# EasyEDA Pro project bend Platform.eprj

# Schematic Schematic1
Board Name: Board1; Create Date: 2025-10-15; Page Name: P1; Project Name: bend Platform; Schematic Name: Schematic1; Update Date: 2025-10-27; Company: nmlstyl.art; Page Size: A4; Version: V1.0
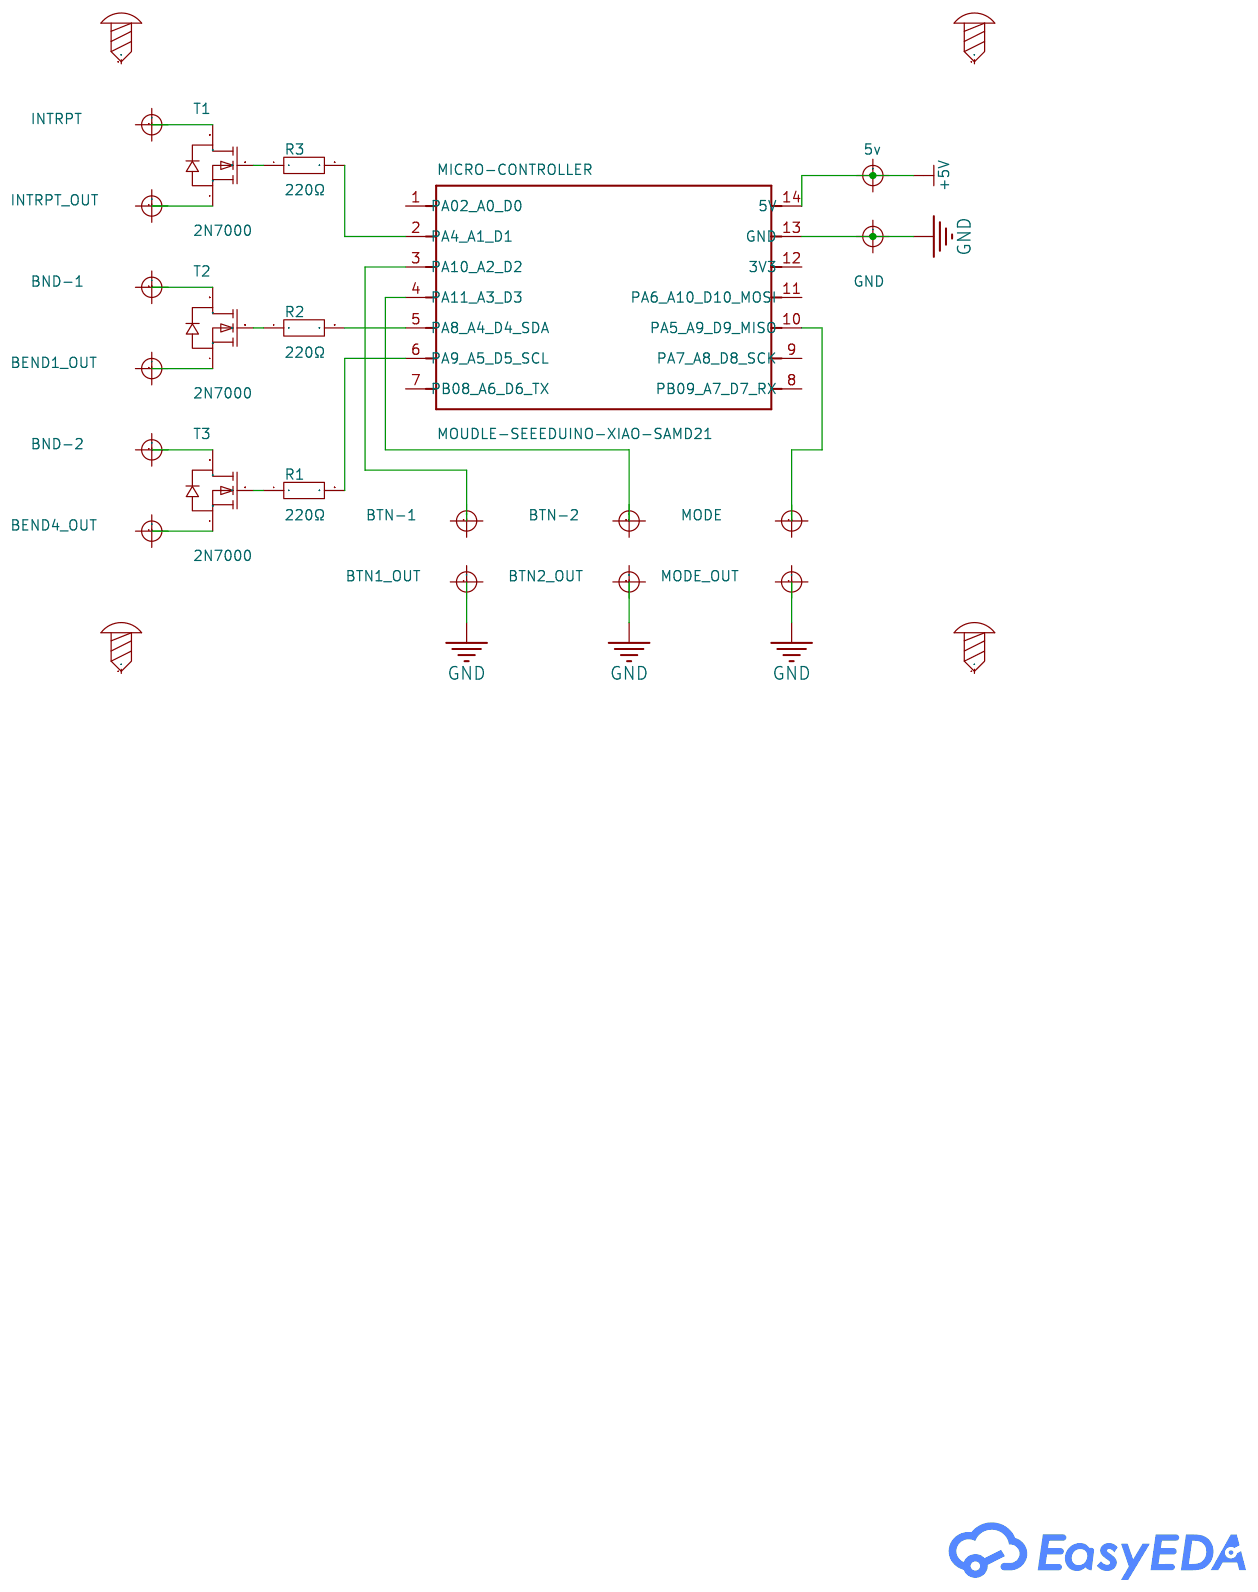
[diagram p0: schematic sheet]

## Parts
5v  -  [Mark-Point-1mm]  (no BOM)
BEND1_OUT  -  [Mark-Point-1mm]  (no BOM)
BEND4_OUT  -  [Mark-Point-1mm]  (no BOM)
BND-1  -  [Mark-Point-1mm]  (no BOM)
BND-2  -  [Mark-Point-1mm]  (no BOM)
BTN1_OUT  -  [Mark-Point-1mm]  (no BOM)
BTN2_OUT  -  [Mark-Point-1mm]  (no BOM)
BTN-1  -  [Mark-Point-1mm]  (no BOM)
BTN-2  -  [Mark-Point-1mm]  (no BOM)
GND  -  [Mark-Point-1mm]  (no BOM)
INTRPT  -  [Mark-Point-1mm]  (no BOM)
INTRPT_OUT  -  [Mark-Point-1mm]  (no BOM)
MICRO-CONTROLLER  MOUDLE-SEEEDUINO-XIAO-SAMD21  [DIP-14_L34.8-W35.1_ER35-444UH]
MODE  -  [Mark-Point-1mm]  (no BOM)
MODE_OUT  -  [Mark-Point-1mm]  (no BOM)
R1  220Ω  [R_AXIAL-0.4]
R2  220Ω  [R_AXIAL-0.4]
R3  220Ω  [R_AXIAL-0.4]
T1  2N7000  [TO-92-3_L4.9-W3.7-P1.27-L]
T2  2N7000  [TO-92-3_L4.9-W3.7-P1.27-L]
T3  2N7000  [TO-92-3_L4.9-W3.7-P1.27-L]
U1  -  [Screw-Hole-M2]
U2  -  [Screw-Hole-M2]
U3  -  [Screw-Hole-M2]
U4  -  [Screw-Hole-M2]

## Library data of the parts
5v BEND1_OUT BEND4_OUT BND-1 BND-2 BTN1_OUT BTN2_OUT BTN-1 BTN-2 GND INTRPT INTRPT_OUT MODE MODE_OUT = Mark-Point: Mark点
MICRO-CONTROLLER = MOUDLE-SEEEDUINO-XIAO
R1-R3 = Res_AXIAL-1/4W: Supplier Footprint: Through
T1-T3 = 2N7000: Type:1 N-Channel Drain Source Voltage (Vdss): Continuous Drain Current (Id): Drain Source On Resistance (RDS(on)@Vgs,Id):5Ω@10V,500mA Power Dissipation (Pd): Gate Threshold Voltage (Vgs(th)@Id):3V@1mA; LCSC Part Name: 1个N沟道 耐压:60V 电流:200mA; Supplier Part: C232838; Manufacturer: onsemi(安森美); Supplier Footprint: TO-92-3; JLCPCB Part Class: Extended Part; Datasheet: https://atta.szlcsc.com/upload/public/pdf/source/20221020/6B07E43F0B4B9B39AB447A9A1885F5BD.pdf; Supplier: LCSC; Type: 1 N-Channel; Drain Source On Resistance (RDS(on)@Vgs,Id): 5Ω@10V,500mA; Gate Threshold Voltage (Vgs(th)@Id): 3V@1mA
U1-U4 = Screw-Hole-M2: Supplier Footprint: 插件

## Nets
+5V: 5v.1 MICRO-CONTROLLER.14(5V)
GND: BTN1_OUT.1 BTN2_OUT.1 GND.1 MICRO-CONTROLLER.13(GND) MODE_OUT.1
$1N485: MICRO-CONTROLLER.6(PA9_A5_D5_SCL) R1.2
$1N498: MICRO-CONTROLLER.2(PA4_A1_D1) R3.2
$1N1196: INTRPT_OUT.1 T1.1(S)
$1N1200: INTRPT.1 T1.3(D)
$1N1204: BND-1.1 T2.3(D)
$1N1209: BEND1_OUT.1 T2.1(S)
$1N1214: BND-2.1 T3.3(D)
$1N1219: BEND4_OUT.1 T3.1(S)
$1N1737: BTN-1.1 MICRO-CONTROLLER.3(PA10_A2_D2)
$1N1744: BTN-2.1 MICRO-CONTROLLER.4(PA11_A3_D3)
$1N1755: MICRO-CONTROLLER.10(PA5_A9_D9_MISO) MODE.1
$1N3132: R3.1 T1.2(G)
$1N3137: MICRO-CONTROLLER.5(PA8_A4_D4_SDA) R2.2
$1N3148: R2.1 T2.2(G)
$1N4801: R1.1 T3.2(G)

Not connected (* = marked no-connect by the designer): MICRO-CONTROLLER 1(PA02_A0_D0) 7(PB08_A6_D6_TX) 8(PB09_A7_D7_RX) 9(PA7_A8_D8_SCK) 11(PA6_A10_D10_MOSI) 12(3V3); U1 1; U2 1; U3 1; U4 1

# Schematic Schematic2
Board Name: PCB2; Create Date: 2025-10-20; Page Name: P1; Project Name: bend Platform; Schematic Name: Schematic2; Update Date: 2025-10-24; Company: nmlstyl.art; Page Size: A4; Version: V1.0
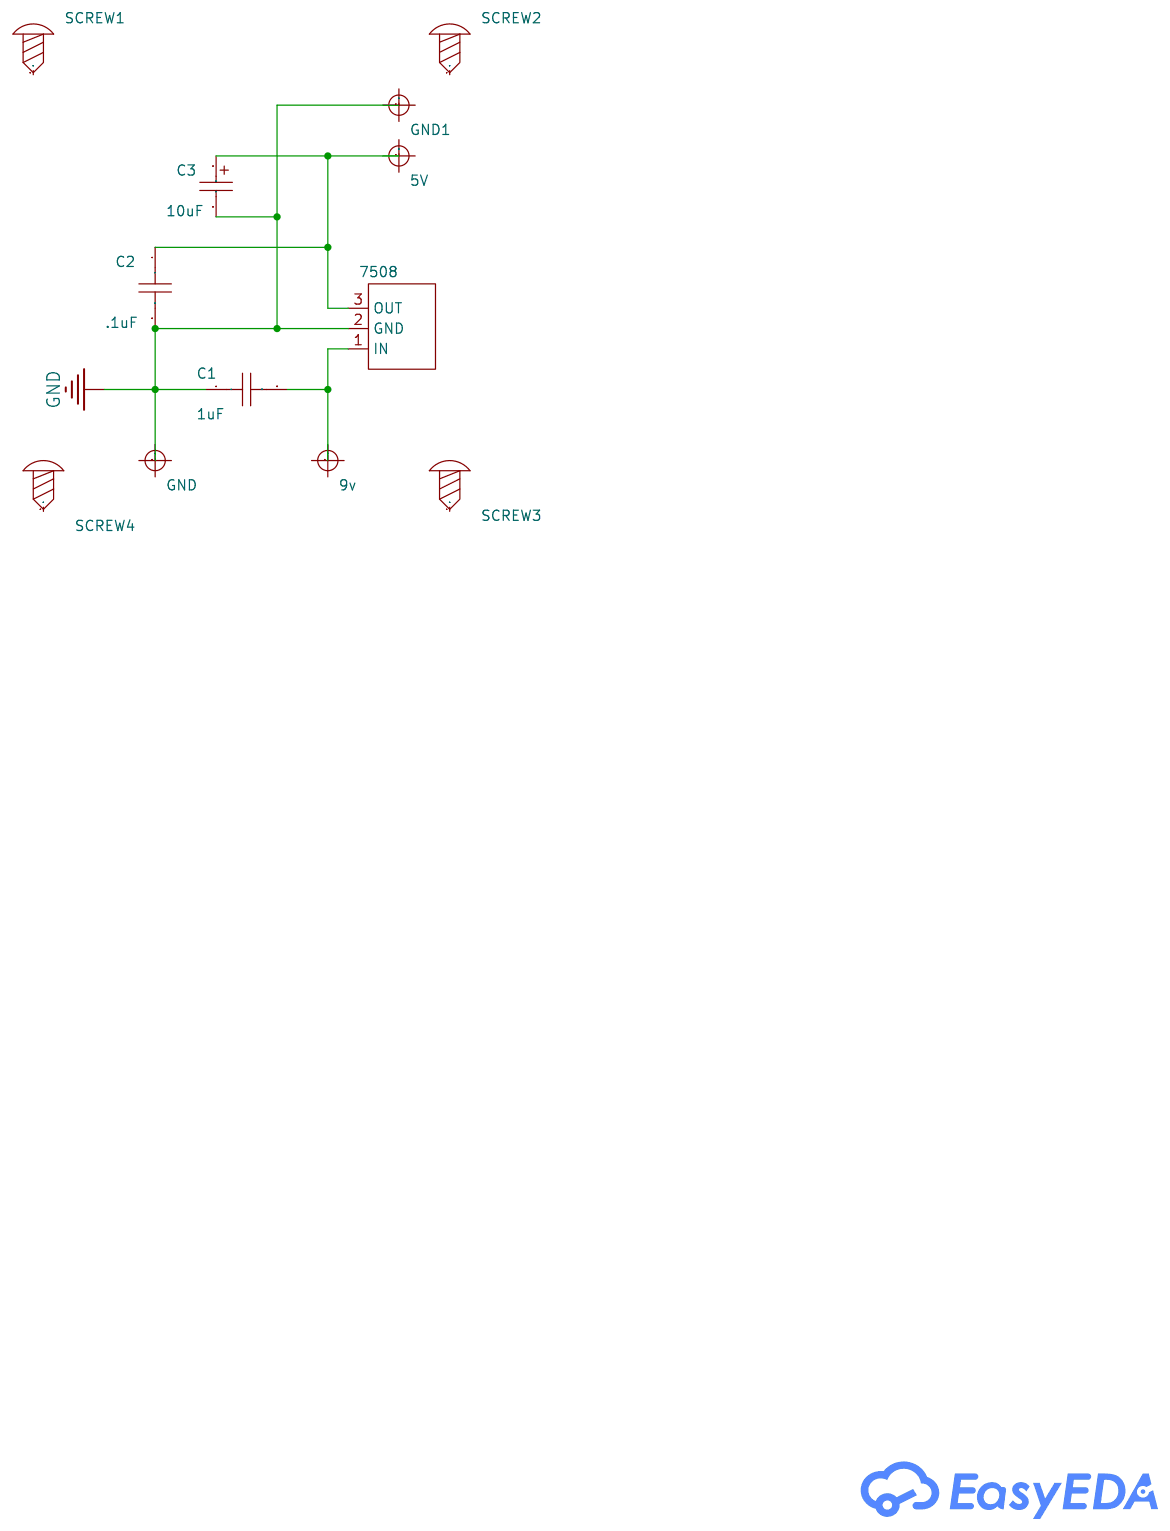
[diagram p1: schematic sheet]

## Parts
5V  -  [Mark-Point-1mm]  (no BOM)
9v  -  [Mark-Point-1mm]  (no BOM)
7508  7805  [TO-220-3_L10.0-W4.5-P2.54-L_IXTP44P15T]
C1  1uF  [CAP-TH_joey-ceramic]
C2  .1uF  [CAP-TH_joey-ceramic]
C3  10uF  [CAP-THT-joey-4mm]
GND  -  [Mark-Point-1mm]  (no BOM)
GND1  -  [Mark-Point-1mm]  (no BOM)
SCREW1  -  [Screw-Hole-M2]
SCREW2  -  [Screw-Hole-M2]
SCREW3  -  [Screw-Hole-M2]
SCREW4  -  [Screw-Hole-M2]

## Library data of the parts
5V 9v GND GND1 = Mark-Point: Mark点
7508 = 7805: Supplier Part: C2941265; Supplier Footprint: TO-220; JLCPCB Part Class: Extended Part; Supplier: LCSC
C1 C2 = CAP_0201: Supplier Footprint: 0201
C3 = C_Ele_SMD_3x5.4mm: Supplier Footprint: SMD,3x5.4mm
SCREW1-SCREW4 = Screw-Hole-M2: Supplier Footprint: 插件

## Nets
GND: 7508.2(GND) C1.1 C2.2 C3.2 GND.1 GND1.1
$1N199: 5V.1 7508.3(OUT) C2.1 C3.1
$1N200: 9v.1 7508.1(IN) C1.2

Not connected (* = marked no-connect by the designer): SCREW1 1; SCREW2 1; SCREW3 1; SCREW4 1

# Board PCB1
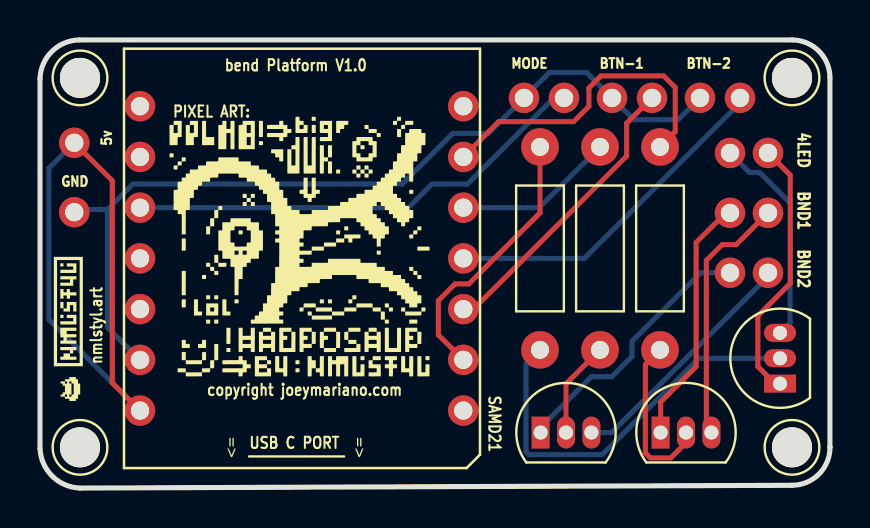
[diagram p2: board, top side]
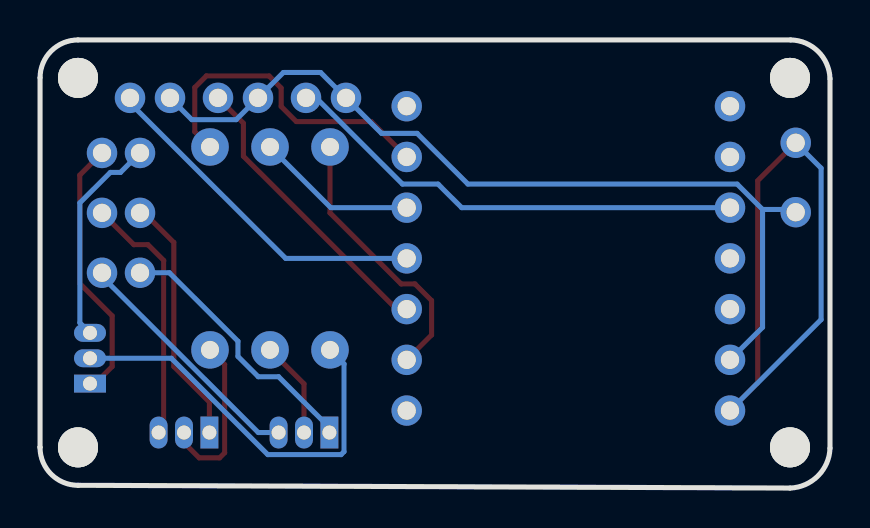
[diagram p3: board, bottom side, seen from below]

Outline 39.5 x 22.44 mm; copper layers: Top Layer, Bottom Layer. Coordinates in mm from the lower left corner of the outline.
Outline path: 0,20.5 arc(0.6,21.86) 1.97,22.44 37.6,22.44 arc(38.94,21.88) 39.5,20.54 39.5,2.04 arc(39.5,2.04) 39.5,2.04 arc(38.94,0.69) 37.6,0.14 2,0 arc(0.61,0.6) 0,1.99 0,20.5
Stack: Top Layer 0.035mm / Dielectric1 1.51mm FR4 er 4.5 / Bottom Layer 0.035mm

## Design rules (mm)
template: JLCPCB Capability(Two Layers Board)
spacing copperThickness1oz (default): track to track 0.102, other pairs 0.152 to 0.3
spacing copperThickness2oz: track to track 0.203, other pairs 0.152 to 0.3
track width copperThickness1oz (default): min 0.127, default 0.254, max 2.54
track width copperThickness2oz: min 0.203, default 0.254, max 2.54
differential pair differentialPair (default): width min 0.127, default 0.254, max 2.54; gap min 0.152, default 0.152
via viaSize (default): diameter min 0.5, default 0.61, max 10; hole min 0.3, default 0.305, max 6.3

## Placement (name value [footprint] x y rotation side)
5v  -  [Mark-Point-1mm]  1.71 17.29 180 top
BEND1_OUT  -  [Mark-Point-1mm]  34.5 10.78 270 top
BEND4_OUT  -  [Mark-Point-1mm]  34.5 13.78 270 top
BND-1  -  [Mark-Point-1mm]  36.4 10.78 270 top
BND-2  -  [Mark-Point-1mm]  36.4 13.78 270 top
BTN1_OUT  -  [Mark-Point-1mm]  28.6 19.54 270 top
BTN2_OUT  -  [Mark-Point-1mm]  33 19.54 270 top
BTN-1  -  [Mark-Point-1mm]  30.6 19.54 270 top
BTN-2  -  [Mark-Point-1mm]  35 19.54 270 top
GND  -  [Mark-Point-1mm]  1.71 13.81 180 top
INTRPT  -  [Mark-Point-1mm]  34.5 16.78 90 top
INTRPT_OUT  -  [Mark-Point-1mm]  36.4 16.78 90 top
MICRO-CONTROLLER  MOUDLE-SEEEDUINO-XIAO-SAMD21  [MOUDLE14P-2.54-21X17.8MM]  22 22 180 top
MODE  -  [Mark-Point-1mm]  26.2 19.54 270 top
MODE_OUT  -  [Mark-Point-1mm]  24.2 19.54 270 top
R1  220Ω  [R_AXIAL-0.4]  31 12 90 top
R2  220Ω  [R_AXIAL-0.4]  28 12 90 top
R3  220Ω  [R_AXIAL-0.4]  25 12 90 top
T1  2N7000  [TO-92-3_L4.9-W3.7-P1.27-L]  37 6.5 90 top
T2  2N7000  [TO-92-3_L4.9-W3.7-P1.27-L]  26.3 2.78 0 top
T3  2N7000  [TO-92-3_L4.9-W3.7-P1.27-L]  32.3 2.78 0 top
U1  -  [Screw-Hole-M2]  37.6 2.04 180 top
U2  -  [Screw-Hole-M2]  2 2.04 180 top
U3  -  [Screw-Hole-M2]  2 20.54 180 top
U4  -  [Screw-Hole-M2]  37.6 20.54 180 top

## Footprints (pads in the part's own frame, mm; a bottom-side part is the same pattern mirrored in y, then rotated)
Mark-Point-1mm
  round 1.524 hole 0.914: 1(0,0)
MOUDLE14P-2.54-21X17.8MM
  round 1.524 hole 0.914: 1(0.835,18.12) 2(0.835,15.58) 3(0.835,13.04) 4(0.835,10.5) 5(0.835,7.96) 6(0.835,5.42) 7(0.835,2.88) 8(17,2.88) 9(17,5.42) 10(17,7.96) 11(17,10.5) 12(17,13.04) 13(17,15.58) 14(17,18.12)
R_AXIAL-0.4
  round 1.879 hole 0.899: 1(-5.08,0) 2(5.08,0)
Screw-Hole-M2
  round 2 hole 2: 1(0,0)
TO-92-3_L4.9-W3.7-P1.27-L
  rect 0.9x1.6 hole 0.7: 1(-1.27,0)
  oval 0.9x1.6 hole 0.7: 2(0,0) 3(1.27,0)

## Nets
As in the schematic.

Pads without a net: MICRO-CONTROLLER 1 7 8 9 11 12; U1 1; U2 1; U3 1; U4 1

## Routing (per net, layer and track width the routed paths; a pad name or vN(x,y) marks a point on that pad's centre or on a via; arc(x,y) is an arc through that point)
+5V: length 30.6
  Top Layer w0.254: MICRO-CONTROLLER.14 3.62,5.27 3.62,15.39 5v.1
  Bottom Layer w0.254: MICRO-CONTROLLER.14 0.44,8.44 0.44,16.02 5v.1
GND: length 43.8
  Bottom Layer w0.254: GND.1 1.85,13.95 3.37,13.95 ; MICRO-CONTROLLER.13 3.37,8.05 3.37,13.95 ; 3.37,13.95 4.64,15.22 18.1,15.22 20.64,17.76 22.42,17.76 MODE_OUT.1 25.47,20.81 27.33,20.81 BTN1_OUT.1 29.69,18.45 31.91,18.45 BTN2_OUT.1
$1N485: length 16.3
  Top Layer w0.254: R1.2 31.76,17.84 31.76,20.06 31.18,20.64 28.05,20.64 27.44,20.03 27.44,19.11 26.68,18.35 22.94,18.35 MICRO-CONTROLLER.6
$1N498: length 13.7
  Top Layer w0.254: MICRO-CONTROLLER.2 19.92,7.67 19.92,9.39 20.75,10.22 21.44,10.22 25,13.78 R3.2
$1N1196: length 13.3
  Top Layer w0.254: T1.1 36.75,5.23 35.89,6.08 35.89,8.62 37.51,10.24 37.51,15.67 INTRPT_OUT.1
$1N1200: length 10.8
  Bottom Layer w0.254: INTRPT.1 35.48,15.8 35.98,15.8 37.51,14.28 37.51,8.28 T1.3
$1N1204: length 12.3
  Bottom Layer w0.254: T2.3 28.59,2.78 36.4,10.59 BND-1.1
$1N1209: length 13.4
  Bottom Layer w0.254: BEND1_OUT.1 33.03,10.78 29.6,7.35 29.6,6.59 28.59,5.57 27.57,5.57 25.03,3.03 T2.1
$1N1214: length 12.8
  Top Layer w0.254: T3.3 33.32,3.03 33.32,11.4 34.1,12.19 34.81,12.19 BND-2.1
$1N1219: length 12.6
  Top Layer w0.254: BEND4_OUT.1 34.29,13.78 32.81,12.3 32.81,6.08 31.03,4.3 T3.1
$1N1737: length 14.8
  Top Layer w0.254: MICRO-CONTROLLER.3 21.67,8.96 29.33,16.62 29.33,18.27 BTN-1.1
$1N1744: length 17.3
  Bottom Layer w0.254: MICRO-CONTROLLER.4 27.22,11.5 35,19.28 BTN-2.1
$1N1755: length 23.5
  Bottom Layer w0.254: MODE.1 25.69,19.54 21.37,15.22 19.6,15.22 18.42,14.04 MICRO-CONTROLLER.10
$1N3132: length 20.1
  Bottom Layer w0.254: T1.2 32.94,6.5 28.11,1.67 24.45,1.67 24.3,1.82 24.3,6.22 R3.1
$1N3137: length 8.1
  Bottom Layer w0.254: MICRO-CONTROLLER.5 24.96,14.04 R2.2
$1N3148: length 4.8
  Top Layer w0.254: R2.1 26.3,5.22 T2.2
$1N4801: length 8.4
  Top Layer w0.254: R1.1 30.27,6.19 30.27,1.76 30.52,1.51 31.54,1.51 32.3,2.27 T3.2

## Text on the board
Top Silkscreen Layer: PIXEL ART: | copyright joeymariano.com | bend Platform V1.0 | USB C PORT | SAMD21 | nmlstyl.art | 4LED | BND1 | BND2 | =>

# Board PCB2
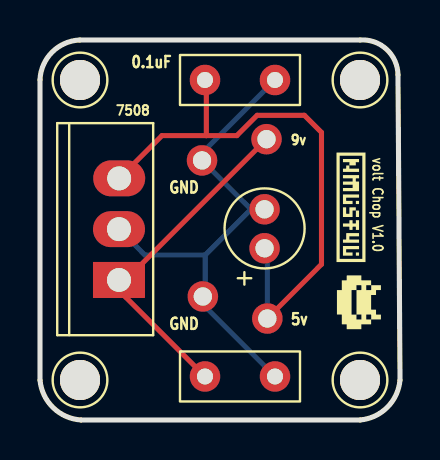
[diagram p4: board, top side]
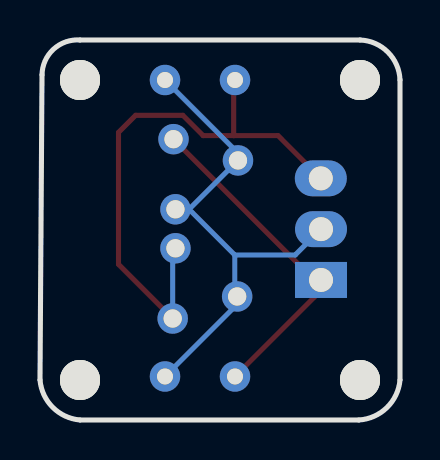
[diagram p5: board, bottom side, seen from below]

Outline 18 x 19 mm; copper layers: Top Layer, Bottom Layer. Coordinates in mm from the lower left corner of the outline.
Outline path: 0,17 0,2 arc(0.66,0.62) 2.06,0 16,0 arc(17.36,0.64) 18,2 17.9,17.25 arc(17.33,18.54) 16,19 2,19 arc(0.61,18.39) 0,17
Stack: Top Layer 0.035mm / Dielectric1 1.51mm FR4 er 4.5 / Bottom Layer 0.035mm

## Design rules (mm)
template: JLCPCB Capability(Two Layers Board)
spacing copperThickness1oz (default): track to track 0.102, other pairs 0.152 to 0.3
spacing copperThickness2oz: track to track 0.203, other pairs 0.152 to 0.3
track width copperThickness1oz (default): min 0.127, default 0.254, max 2.54
track width copperThickness2oz: min 0.203, default 0.254, max 2.54
differential pair differentialPair (default): width min 0.127, default 0.254, max 2.54; gap min 0.152, default 0.152
via viaSize (default): diameter min 0.5, default 0.61, max 10; hole min 0.3, default 0.305, max 6.3

## Placement (name value [footprint] x y rotation side)
5V  -  [Mark-Point-1mm]  11.37 5.08 0 top
9v  -  [Mark-Point-1mm]  11.33 14.04 0 top
7508  7805  [TO-220-3_L10.0-W4.5-P2.54-L_IXTP44P15T]  3.95 9.54 90 top
C1  1uF  [CAP-TH_joey-ceramic]  10 2.18 180 top
C2  .1uF  [CAP-TH_joey-ceramic]  10 17 0 top
C3  10uF  [CAP-THT-joey-4mm]  11.23 9.54 90 top
GND  -  [Mark-Point-1mm]  8.1 12.98 0 top
GND1  -  [Mark-Point-1mm]  8.14 6.18 0 top
SCREW1  -  [Screw-Hole-M2]  2 17 0 top
SCREW2  -  [Screw-Hole-M2]  16 17 0 top
SCREW3  -  [Screw-Hole-M2]  16 2 0 top
SCREW4  -  [Screw-Hole-M2]  2 2 0 top

## Footprints (pads in the part's own frame, mm; a bottom-side part is the same pattern mirrored in y, then rotated)
CAP-TH_joey-ceramic
  round 1.524 hole 0.8: 1(-1.75,0) 2(1.75,0)
CAP-THT-joey-4mm
  round 1.524 hole 0.914: 1(-0.957,0.001) 2(0.993,0.001)
Mark-Point-1mm
  round 1.524 hole 0.914: 1(0,0)
Screw-Hole-M2
  round 2 hole 2: 1(0,0)
TO-220-3_L10.0-W4.5-P2.54-L_IXTP44P15T
  rect 1.8x2.6 hole 1.2: 1(-2.54,0.005)
  oval 1.8x2.6 hole 1.2: 2(0,0.005) 3(2.54,-0.005)

## Nets
As in the schematic.

Pads without a net: SCREW1 1; SCREW2 1; SCREW3 1; SCREW4 1

## Routing (per net, layer and track width the routed paths; a pad name or vN(x,y) marks a point on that pad's centre or on a via; arc(x,y) is an arc through that point)
GND: length 25.4
  Bottom Layer w0.254: C1.1 8.14,5.78 GND1.1 8.26,6.29 8.26,8.25 ; 10.55,10.54 GND.1 8.1,13.35 C2.2 ; 10.55,10.54 C3.2 ; 10.55,10.54 8.26,8.25 ; 8.26,8.25 5.24,8.25 7508.2
$1N199: length 28.6
  Top Layer w0.254: 8.32,14.22 8.32,16.93 C2.1 ; 8.32,14.22 9.84,14.22 10.86,15.23 13.22,15.23 14.07,14.38 14.07,7.78 5V.1 ; 8.32,14.22 6.1,14.22 7508.3
  Bottom Layer w0.254: C3.1 11.37,8.45 5V.1
$1N200: length 16.8
  Top Layer w0.254: 4.29,7 7508.1 ; 4.29,7 9v.1 ; 4.29,7 4.29,6.14 C1.2

## Text on the board
Top Silkscreen Layer: volt Chop V1.0 | 5v | GND | 0.1uF
